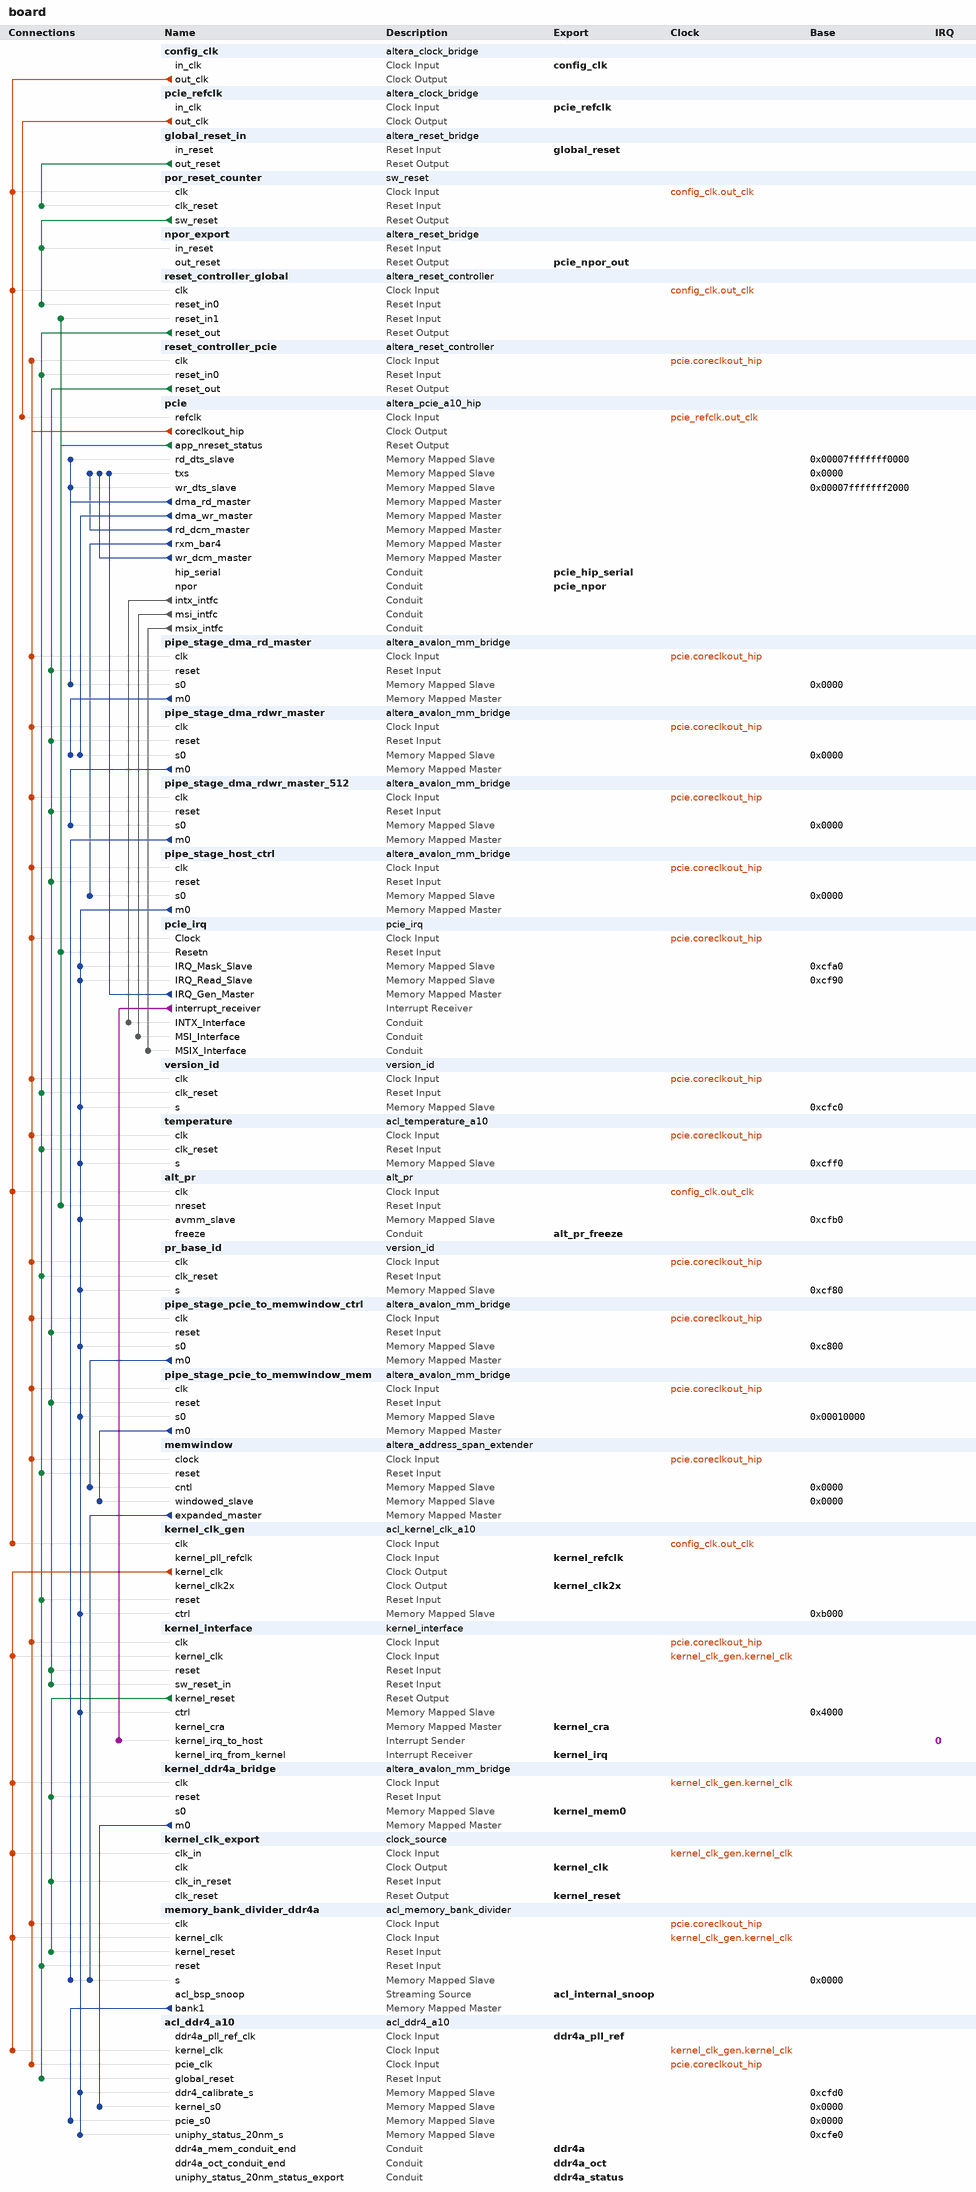
[diagram p0: system contents]
# Platform Designer (Qsys) system board, Arria 10 10AX115S2F45I1SG
# Parameters at their usual value, and those the tool derives, are not listed.
package require -exact qsys 1.0
create_system board
set_project_property DEVICE_FAMILY {Arria 10}
set_project_property DEVICE 10AX115S2F45I1SG

add_component config_clk ip/board/board_config_clk.ip altera_clock_bridge config_clk 16.1

add_component pcie_refclk ip/board/board_pcie_refclk.ip altera_clock_bridge pcie_refclk 16.1
load_component pcie_refclk
set_component_parameter_value DERIVED_CLOCK_RATE 0
set_component_parameter_value EXPLICIT_CLOCK_RATE 100000000
save_component

add_component global_reset_in ip/board/board_global_reset_in.ip altera_reset_bridge global_reset_in 16.1

add_component por_reset_counter ip/board/board_por_reset_counter.ip sw_reset por_reset_counter 10.0
load_component por_reset_counter
set_component_parameter_value WIDTH 8
set_component_parameter_value LOG2_RESET_CYCLES 10
set_component_parameter_value WIDTH_BYTES 1
save_component

add_component npor_export ip/board/board_npor_export.ip altera_reset_bridge npor_export 16.1

add_component reset_controller_global ip/board/board_reset_controller_global.ip altera_reset_controller reset_controller_global 16.1
load_component reset_controller_global
set_component_parameter_value NUM_RESET_INPUTS 2
set_component_parameter_value SYNC_DEPTH 2
set_component_parameter_value ADAPT_RESET_REQUEST 0
save_component

add_component reset_controller_pcie ip/board/board_reset_controller_pcie.ip altera_reset_controller reset_controller_pcie 16.1
load_component reset_controller_pcie
set_component_parameter_value NUM_RESET_INPUTS 1
set_component_parameter_value SYNC_DEPTH 2
set_component_parameter_value ADAPT_RESET_REQUEST 0
save_component

add_component pcie ip/board/board_pcie.ip altera_pcie_a10_hip pcie 16.1

add_component pipe_stage_dma_rd_master ip/board/board_pipe_stage_dma_rd_master.ip altera_avalon_mm_bridge pipe_stage_dma_rd_master 16.1
load_component pipe_stage_dma_rd_master
set_component_parameter_value DATA_WIDTH 256
set_component_parameter_value ADDRESS_WIDTH 31
set_component_parameter_value USE_AUTO_ADDRESS_WIDTH 1
set_component_parameter_value ADDRESS_UNITS SYMBOLS
set_component_parameter_value MAX_BURST_SIZE 16
set_component_parameter_value MAX_PENDING_RESPONSES 4
save_component

add_component pipe_stage_dma_rdwr_master ip/board/board_pipe_stage_dma_rdwr_master.ip altera_avalon_mm_bridge pipe_stage_dma_rdwr_master 16.1

add_component pipe_stage_dma_rdwr_master_512 ip/board/board_pipe_stage_dma_rdwr_master_512.ip altera_avalon_mm_bridge pipe_stage_dma_rdwr_master_512 16.1

add_component pipe_stage_host_ctrl ip/board/board_pipe_stage_host_ctrl.ip altera_avalon_mm_bridge pipe_stage_host_ctrl 16.1
load_component pipe_stage_host_ctrl
set_component_parameter_value DATA_WIDTH 32
set_component_parameter_value ADDRESS_WIDTH 18
set_component_parameter_value USE_AUTO_ADDRESS_WIDTH 0
set_component_parameter_value ADDRESS_UNITS SYMBOLS
set_component_parameter_value MAX_PENDING_RESPONSES 1
save_component

add_component pcie_irq ip/board/board_pcie_irq.ip pcie_irq pcie_irq 1.0
load_component pcie_irq
save_component

add_component version_id ip/board/board_version_id.ip version_id version_id 10.0
load_component version_id
set_component_parameter_value WIDTH 32
set_component_parameter_value VERSION_ID -1597521438
save_component

add_component temperature ip/board/board_temperature.ip acl_temperature_a10 temperature 15.1
load_component temperature
save_component

add_component alt_pr ip/board/board_alt_pr.ip alt_pr alt_pr 16.1
load_component alt_pr
set_component_parameter_value PR_INTERNAL_HOST true
set_component_parameter_value ENABLE_JTAG false
set_component_parameter_value ENABLE_AVMM_SLAVE true
set_component_parameter_value ENABLE_INTERRUPT false
set_component_parameter_value ENABLE_PRPOF_ID_CHECK_UI false
set_component_parameter_value ENABLE_PRPOF_ID_CHECK true
set_component_parameter_value EXT_HOST_PRPOF_ID 0
set_component_parameter_value EXT_HOST_TARGET_DEVICE_FAMILY {Stratix V}
set_component_parameter_value DATA_WIDTH_INDEX 32
set_component_parameter_value CB_DATA_WIDTH 32
set_component_parameter_value ENABLE_DATA_PACKING false
set_component_parameter_value CDRATIO 1
set_component_parameter_value EDCRC_OSC_DIVIDER 1
set_component_parameter_value ENABLE_ENHANCED_DECOMPRESSION false
set_component_parameter_value INSTANTIATE_PR_BLOCK true
set_component_parameter_value INSTANTIATE_CRC_BLOCK true
set_component_parameter_value GENERATE_SDC true
save_component

add_component pr_base_id ip/board/board_pr_base_id.ip version_id pr_base_id 10.0
load_component pr_base_id
set_component_parameter_value WIDTH 32
set_component_parameter_value VERSION_ID -559038737
save_component

add_component pipe_stage_pcie_to_memwindow_ctrl ip/board/board_pipe_stage_pcie_to_memwindow_ctrl.ip altera_avalon_mm_bridge pipe_stage_pcie_to_memwindow_ctrl 16.1
load_component pipe_stage_pcie_to_memwindow_ctrl
set_component_parameter_value DATA_WIDTH 64
set_component_parameter_value ADDRESS_WIDTH 10
set_component_parameter_value USE_AUTO_ADDRESS_WIDTH 0
set_component_parameter_value ADDRESS_UNITS SYMBOLS
set_component_parameter_value MAX_PENDING_RESPONSES 1
save_component

add_component pipe_stage_pcie_to_memwindow_mem ip/board/board_pipe_stage_pcie_to_memwindow_mem.ip altera_avalon_mm_bridge pipe_stage_pcie_to_memwindow_mem 16.1
load_component pipe_stage_pcie_to_memwindow_mem
set_component_parameter_value DATA_WIDTH 512
set_component_parameter_value ADDRESS_WIDTH 16
set_component_parameter_value USE_AUTO_ADDRESS_WIDTH 0
set_component_parameter_value ADDRESS_UNITS SYMBOLS
set_component_parameter_value MAX_PENDING_RESPONSES 1
save_component

add_component memwindow ip/board/board_memwindow.ip altera_address_span_extender memwindow 16.1

add_component kernel_clk_gen ip/board/board_kernel_clk_gen.ip acl_kernel_clk_a10 kernel_clk_gen 16.1
load_component kernel_clk_gen
set_component_parameter_value REF_CLK_RATE 125.0
set_component_parameter_value KERNEL_TARGET_CLOCK_RATE 400.0
save_component

add_component kernel_interface ip/board/board_kernel_interface.ip kernel_interface kernel_interface 15.1

add_component kernel_ddr4a_bridge ip/board/board_kernel_ddr4a_bridge.ip altera_avalon_mm_bridge kernel_ddr4a_bridge 16.1

add_component kernel_clk_export ip/board/board_kernel_clk_export.ip clock_source kernel_clk_export 
load_component kernel_clk_export
set_component_parameter_value clockFrequency 50000000
set_component_parameter_value clockFrequencyKnown false
set_component_parameter_value resetSynchronousEdges DEASSERT
save_component

add_component memory_bank_divider_ddr4a ip/board/board_memory_bank_divider_ddr4a.ip acl_memory_bank_divider memory_bank_divider_ddr4a 1.0
load_component memory_bank_divider_ddr4a
set_component_parameter_value NUM_BANKS 1
set_component_parameter_value SEPARATE_RW_PORTS false
set_component_parameter_value PIPELINE_OUTPUTS false
set_component_parameter_value SPLIT_ON_BURSTBOUNDARY true
set_component_parameter_value DATA_WIDTH 512
set_component_parameter_value ADDRESS_WIDTH 31
set_component_parameter_value BURST_SIZE 16
set_component_parameter_value MAX_PENDING_READS 32
save_component

add_instance acl_ddr4_a10 acl_ddr4_a10 1.0

# connections
add_connection config_clk.out_clk alt_pr.clk clock
add_connection config_clk.out_clk kernel_clk_gen.clk clock
add_connection config_clk.out_clk por_reset_counter.clk clock
add_connection config_clk.out_clk reset_controller_global.clk clock
add_connection kernel_clk_gen.kernel_clk acl_ddr4_a10.kernel_clk clock
add_connection kernel_clk_gen.kernel_clk kernel_clk_export.clk_in clock
add_connection kernel_clk_gen.kernel_clk kernel_ddr4a_bridge.clk clock
add_connection kernel_clk_gen.kernel_clk kernel_interface.kernel_clk clock
add_connection kernel_clk_gen.kernel_clk memory_bank_divider_ddr4a.kernel_clk clock
add_connection pcie.coreclkout_hip acl_ddr4_a10.pcie_clk clock
add_connection pcie.coreclkout_hip kernel_interface.clk clock
add_connection pcie.coreclkout_hip memory_bank_divider_ddr4a.clk clock
add_connection pcie.coreclkout_hip memwindow.clock clock
add_connection pcie.coreclkout_hip pcie_irq.Clock clock
add_connection pcie.coreclkout_hip pipe_stage_dma_rd_master.clk clock
add_connection pcie.coreclkout_hip pipe_stage_dma_rdwr_master.clk clock
add_connection pcie.coreclkout_hip pipe_stage_dma_rdwr_master_512.clk clock
add_connection pcie.coreclkout_hip pipe_stage_host_ctrl.clk clock
add_connection pcie.coreclkout_hip pipe_stage_pcie_to_memwindow_ctrl.clk clock
add_connection pcie.coreclkout_hip pipe_stage_pcie_to_memwindow_mem.clk clock
add_connection pcie.coreclkout_hip pr_base_id.clk clock
add_connection pcie.coreclkout_hip reset_controller_pcie.clk clock
add_connection pcie.coreclkout_hip temperature.clk clock
add_connection pcie.coreclkout_hip version_id.clk clock
add_connection pcie_refclk.out_clk pcie.refclk clock
add_connection global_reset_in.out_reset por_reset_counter.clk_reset reset
add_connection kernel_interface.kernel_reset kernel_clk_export.clk_in_reset reset
add_connection kernel_interface.kernel_reset kernel_ddr4a_bridge.reset reset
add_connection kernel_interface.kernel_reset memory_bank_divider_ddr4a.kernel_reset reset
add_connection pcie.app_nreset_status alt_pr.nreset reset
add_connection pcie.app_nreset_status pcie_irq.Resetn reset
add_connection pcie.app_nreset_status reset_controller_global.reset_in1 reset
add_connection por_reset_counter.sw_reset npor_export.in_reset reset
add_connection por_reset_counter.sw_reset reset_controller_global.reset_in0 reset
add_connection reset_controller_global.reset_out acl_ddr4_a10.global_reset reset
add_connection reset_controller_global.reset_out kernel_clk_gen.reset reset
add_connection reset_controller_global.reset_out memory_bank_divider_ddr4a.reset reset
add_connection reset_controller_global.reset_out memwindow.reset reset
add_connection reset_controller_global.reset_out pr_base_id.clk_reset reset
add_connection reset_controller_global.reset_out reset_controller_pcie.reset_in0 reset
add_connection reset_controller_global.reset_out temperature.clk_reset reset
add_connection reset_controller_global.reset_out version_id.clk_reset reset
add_connection reset_controller_pcie.reset_out kernel_interface.reset reset
add_connection reset_controller_pcie.reset_out kernel_interface.sw_reset_in reset
add_connection reset_controller_pcie.reset_out pipe_stage_dma_rd_master.reset reset
add_connection reset_controller_pcie.reset_out pipe_stage_dma_rdwr_master.reset reset
add_connection reset_controller_pcie.reset_out pipe_stage_dma_rdwr_master_512.reset reset
add_connection reset_controller_pcie.reset_out pipe_stage_host_ctrl.reset reset
add_connection reset_controller_pcie.reset_out pipe_stage_pcie_to_memwindow_ctrl.reset reset
add_connection reset_controller_pcie.reset_out pipe_stage_pcie_to_memwindow_mem.reset reset
add_connection kernel_ddr4a_bridge.m0 acl_ddr4_a10.kernel_s0 avalon
set_connection_parameter_value kernel_ddr4a_bridge.m0/acl_ddr4_a10.kernel_s0 baseAddress 0x0000
add_connection memory_bank_divider_ddr4a.bank1 acl_ddr4_a10.pcie_s0 avalon
set_connection_parameter_value memory_bank_divider_ddr4a.bank1/acl_ddr4_a10.pcie_s0 baseAddress 0x0000
add_connection memwindow.expanded_master memory_bank_divider_ddr4a.s avalon
set_connection_parameter_value memwindow.expanded_master/memory_bank_divider_ddr4a.s baseAddress 0x0000
add_connection pcie.dma_rd_master pcie.rd_dts_slave avalon
set_connection_parameter_value pcie.dma_rd_master/pcie.rd_dts_slave baseAddress 0x00007fffffff0000
add_connection pcie.dma_rd_master pcie.wr_dts_slave avalon
set_connection_parameter_value pcie.dma_rd_master/pcie.wr_dts_slave baseAddress 0x00007fffffff2000
add_connection pcie.dma_rd_master pipe_stage_dma_rd_master.s0 avalon
set_connection_parameter_value pcie.dma_rd_master/pipe_stage_dma_rd_master.s0 baseAddress 0x0000
add_connection pcie.dma_wr_master pipe_stage_dma_rdwr_master.s0 avalon
set_connection_parameter_value pcie.dma_wr_master/pipe_stage_dma_rdwr_master.s0 baseAddress 0x0000
add_connection pcie.rd_dcm_master pcie.txs avalon
set_connection_parameter_value pcie.rd_dcm_master/pcie.txs baseAddress 0x0000
add_connection pcie.rxm_bar4 pipe_stage_host_ctrl.s0 avalon
set_connection_parameter_value pcie.rxm_bar4/pipe_stage_host_ctrl.s0 baseAddress 0x0000
add_connection pcie.wr_dcm_master pcie.txs avalon
set_connection_parameter_value pcie.wr_dcm_master/pcie.txs baseAddress 0x0000
add_connection pcie_irq.IRQ_Gen_Master pcie.txs avalon
set_connection_parameter_value pcie_irq.IRQ_Gen_Master/pcie.txs baseAddress 0x0000
add_connection pipe_stage_dma_rd_master.m0 pipe_stage_dma_rdwr_master.s0 avalon
set_connection_parameter_value pipe_stage_dma_rd_master.m0/pipe_stage_dma_rdwr_master.s0 baseAddress 0x0000
add_connection pipe_stage_dma_rdwr_master.m0 pipe_stage_dma_rdwr_master_512.s0 avalon
set_connection_parameter_value pipe_stage_dma_rdwr_master.m0/pipe_stage_dma_rdwr_master_512.s0 baseAddress 0x0000
add_connection pipe_stage_dma_rdwr_master_512.m0 memory_bank_divider_ddr4a.s avalon
set_connection_parameter_value pipe_stage_dma_rdwr_master_512.m0/memory_bank_divider_ddr4a.s baseAddress 0x0000
add_connection pipe_stage_host_ctrl.m0 acl_ddr4_a10.ddr4_calibrate_s avalon
set_connection_parameter_value pipe_stage_host_ctrl.m0/acl_ddr4_a10.ddr4_calibrate_s baseAddress 0xcfd0
add_connection pipe_stage_host_ctrl.m0 acl_ddr4_a10.uniphy_status_20nm_s avalon
set_connection_parameter_value pipe_stage_host_ctrl.m0/acl_ddr4_a10.uniphy_status_20nm_s baseAddress 0xcfe0
add_connection pipe_stage_host_ctrl.m0 alt_pr.avmm_slave avalon
set_connection_parameter_value pipe_stage_host_ctrl.m0/alt_pr.avmm_slave baseAddress 0xcfb0
add_connection pipe_stage_host_ctrl.m0 kernel_clk_gen.ctrl avalon
set_connection_parameter_value pipe_stage_host_ctrl.m0/kernel_clk_gen.ctrl baseAddress 0xb000
add_connection pipe_stage_host_ctrl.m0 kernel_interface.ctrl avalon
set_connection_parameter_value pipe_stage_host_ctrl.m0/kernel_interface.ctrl baseAddress 0x4000
add_connection pipe_stage_host_ctrl.m0 pcie_irq.IRQ_Mask_Slave avalon
set_connection_parameter_value pipe_stage_host_ctrl.m0/pcie_irq.IRQ_Mask_Slave baseAddress 0xcfa0
add_connection pipe_stage_host_ctrl.m0 pcie_irq.IRQ_Read_Slave avalon
set_connection_parameter_value pipe_stage_host_ctrl.m0/pcie_irq.IRQ_Read_Slave baseAddress 0xcf90
add_connection pipe_stage_host_ctrl.m0 pipe_stage_pcie_to_memwindow_ctrl.s0 avalon
set_connection_parameter_value pipe_stage_host_ctrl.m0/pipe_stage_pcie_to_memwindow_ctrl.s0 baseAddress 0xc800
add_connection pipe_stage_host_ctrl.m0 pipe_stage_pcie_to_memwindow_mem.s0 avalon
set_connection_parameter_value pipe_stage_host_ctrl.m0/pipe_stage_pcie_to_memwindow_mem.s0 baseAddress 0x00010000
add_connection pipe_stage_host_ctrl.m0 pr_base_id.s avalon
set_connection_parameter_value pipe_stage_host_ctrl.m0/pr_base_id.s baseAddress 0xcf80
add_connection pipe_stage_host_ctrl.m0 temperature.s avalon
set_connection_parameter_value pipe_stage_host_ctrl.m0/temperature.s baseAddress 0xcff0
add_connection pipe_stage_host_ctrl.m0 version_id.s avalon
set_connection_parameter_value pipe_stage_host_ctrl.m0/version_id.s baseAddress 0xcfc0
add_connection pipe_stage_pcie_to_memwindow_ctrl.m0 memwindow.cntl avalon
set_connection_parameter_value pipe_stage_pcie_to_memwindow_ctrl.m0/memwindow.cntl baseAddress 0x0000
add_connection pipe_stage_pcie_to_memwindow_mem.m0 memwindow.windowed_slave avalon
set_connection_parameter_value pipe_stage_pcie_to_memwindow_mem.m0/memwindow.windowed_slave baseAddress 0x0000
add_connection pcie.intx_intfc pcie_irq.INTX_Interface conduit
add_connection pcie.msi_intfc pcie_irq.MSI_Interface conduit
add_connection pcie.msix_intfc pcie_irq.MSIX_Interface conduit
add_connection pcie_irq.interrupt_receiver kernel_interface.kernel_irq_to_host interrupt
set_connection_parameter_value pcie_irq.interrupt_receiver/kernel_interface.kernel_irq_to_host irqNumber 0

# exported interfaces
add_interface acl_internal_snoop avalon_streaming source
set_interface_property acl_internal_snoop EXPORT_OF memory_bank_divider_ddr4a.acl_bsp_snoop
add_interface alt_pr_freeze conduit end
set_interface_property alt_pr_freeze EXPORT_OF alt_pr.freeze
add_interface config_clk clock sink
set_interface_property config_clk EXPORT_OF config_clk.in_clk
add_interface ddr4a conduit end
set_interface_property ddr4a EXPORT_OF acl_ddr4_a10.ddr4a_mem_conduit_end
add_interface ddr4a_oct conduit end
set_interface_property ddr4a_oct EXPORT_OF acl_ddr4_a10.ddr4a_oct_conduit_end
add_interface ddr4a_pll_ref clock sink
set_interface_property ddr4a_pll_ref EXPORT_OF acl_ddr4_a10.ddr4a_pll_ref_clk
add_interface ddr4a_status conduit end
set_interface_property ddr4a_status EXPORT_OF acl_ddr4_a10.uniphy_status_20nm_status_export
add_interface global_reset reset sink
set_interface_property global_reset EXPORT_OF global_reset_in.in_reset
add_interface kernel_clk clock source
set_interface_property kernel_clk EXPORT_OF kernel_clk_export.clk
add_interface kernel_clk2x clock source
set_interface_property kernel_clk2x EXPORT_OF kernel_clk_gen.kernel_clk2x
add_interface kernel_cra avalon master
set_interface_property kernel_cra EXPORT_OF kernel_interface.kernel_cra
add_interface kernel_irq interrupt receiver
set_interface_property kernel_irq EXPORT_OF kernel_interface.kernel_irq_from_kernel
add_interface kernel_mem0 avalon slave
set_interface_property kernel_mem0 EXPORT_OF kernel_ddr4a_bridge.s0
add_interface kernel_refclk clock sink
set_interface_property kernel_refclk EXPORT_OF kernel_clk_gen.kernel_pll_refclk
add_interface kernel_reset reset source
set_interface_property kernel_reset EXPORT_OF kernel_clk_export.clk_reset
add_interface pcie_hip_serial conduit end
set_interface_property pcie_hip_serial EXPORT_OF pcie.hip_serial
add_interface pcie_npor conduit end
set_interface_property pcie_npor EXPORT_OF pcie.npor
add_interface pcie_npor_out reset source
set_interface_property pcie_npor_out EXPORT_OF npor_export.out_reset
add_interface pcie_refclk clock sink
set_interface_property pcie_refclk EXPORT_OF pcie_refclk.in_clk

set_interconnect_requirement {$system} qsys_mm.clockCrossingAdapter FIFO
set_interconnect_requirement {$system} qsys_mm.maxAdditionalLatency 0
set_interconnect_requirement new_target new_requirement_name new_requirement_value
set_interconnect_requirement new_target new_requirement_name_0 new_requirement_value

save_system board.qsys
